# Altium schematic sheet AT89xx Development Kit.SchDoc: AT89xx Development Kit
size A4; Author: Tran Tuan; CompanyName: Vnelektronics Co.,Ltd; DrawnBy: Tran Tuan; Engineer: Tran Tuan; Organization: Vnelektronics Co.,Ltd; Address1: 776 Ton Duc Thang; Address2: Lien Chieu, Da Nang; Revision: 1.1; SheetNumber: 01; SheetTotal: 01; ProjectName: AT89xx Development Kit
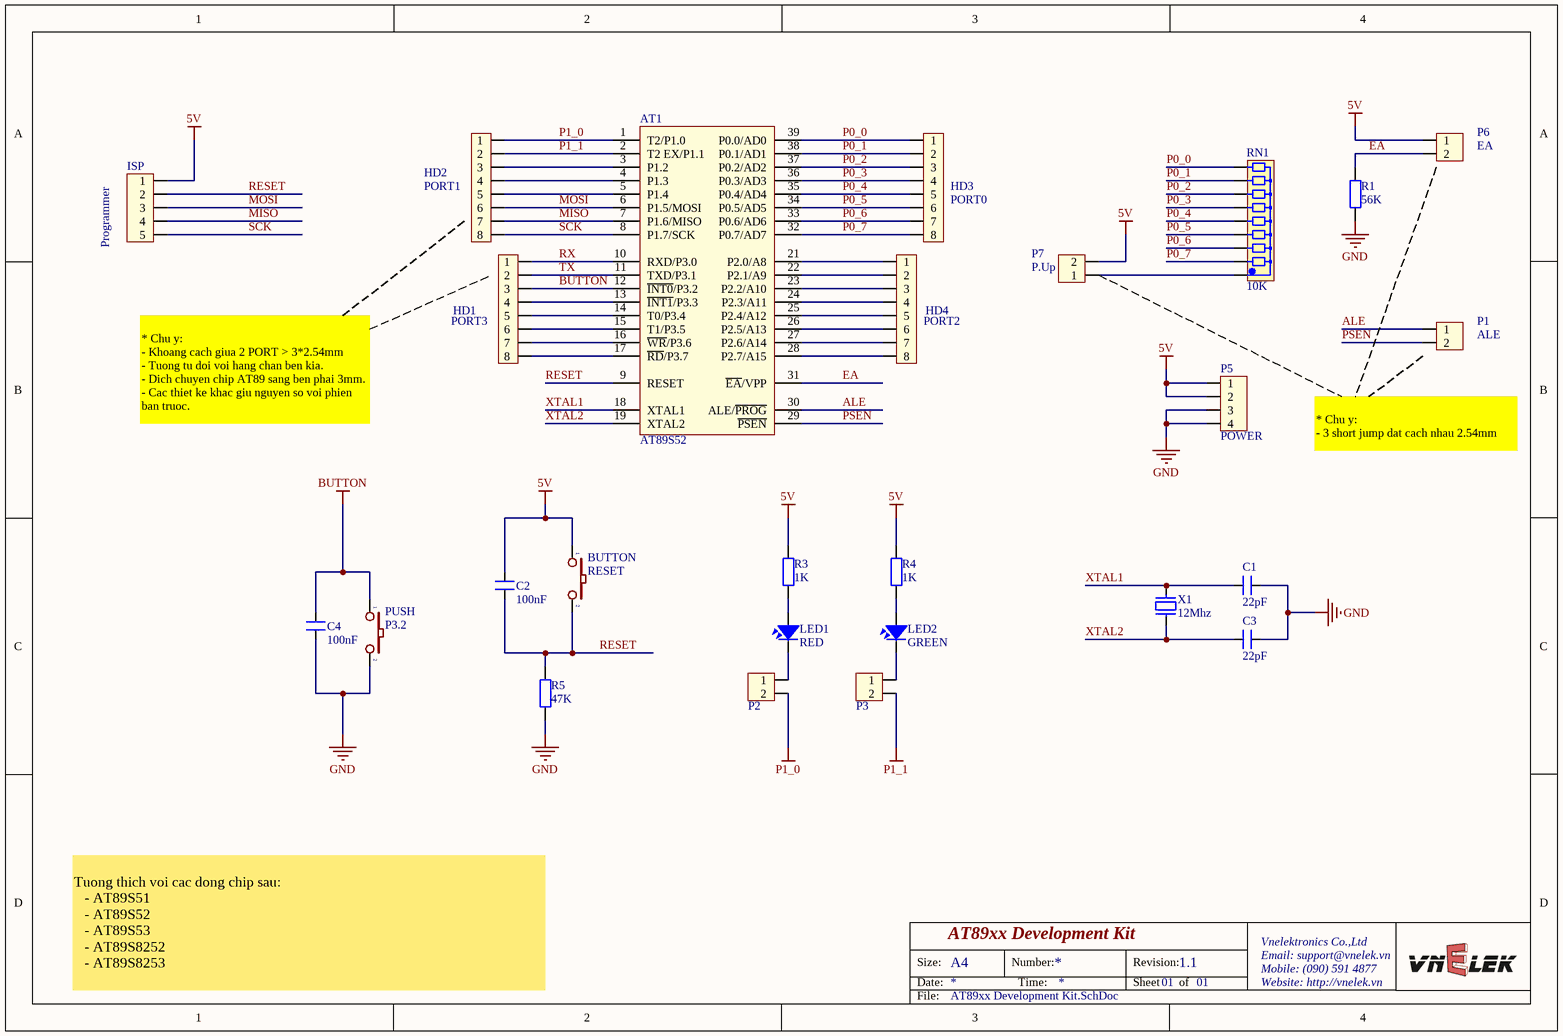
[diagram p0: AT89xx Development Kit.SchDoc]

## Parts
AT1  AT89S52  [de gat xanh dip 40]
BUTTON  RESET  [BUTTON 2PIN TRON]
C1  22pF  [C0603]
C2  100nF  [C0805]
C3  22pF  [C0603]
C4  100nF  [C0805]
HD1  PORT3  [Header_8]
HD2  PORT1  [Header_8]
HD3  PORT0  [Header_8]
HD4  PORT2  [Header_8]
ISP  Programmer  [Header_5]
LED1  RED  [Led 0805R]
LED2  GREEN  [Led 0805G]
P1  ALE  [Header_2]
P2  JUMP  [Header_2]  (value not drawn)
P3  JUMP  [Header_2]  (value not drawn)
P5  POWER  [Header_4]
P6  EA  [Header_2]
P7  P.Up  [Header_2]
PUSH  P3.2  [BUTTON 2PIN TRON]
R1  value 56K  [RESC2012(0805)]  (hidden comment: Res2)
R3  value 1K  [RESC2012(0805)]  (hidden comment: Res2)
R4  value 1K  [RESC2012(0805)]  (hidden comment: Res2)
R5  value 47K  [RESC2012(0805)]  (hidden comment: Res2)
RN1  10K  [RN8]
X1  12Mhz  [CRYSTAL]

## Nets
5V: AT1.40(5V) BUTTON.1 C2.1 ISP.1 P5.1 P5.2 P6.1 P7.2 R3.2 R4.2
BUTTON: AT1.12(~{INT0}/P3.2) C4.1 HD1.3 PUSH.1
GND: AT1.20(GND) C1.1 C3.1 C4.2 P5.3 P5.4 PUSH.2 R1.2 R5.2
P1_0: AT1.1(T2/P1.0) HD2.1 P2.2
P1_1: AT1.2(T2_EX/P1.1) HD2.2 P3.2
ALE: AT1.30(ALE/~{PROG}) P1.1
EA: AT1.31(~{EA}/VPP) P6.2 R1.1
MISO: AT1.7(P1.6/MISO) HD2.7 ISP.4
MOSI: AT1.6(P1.5/MOSI) HD2.6 ISP.3
P0_0: AT1.39(P0.0/AD0) HD3.1 RN1.9
P0_1: AT1.38(P0.1/AD1) HD3.2 RN1.8
P0_2: AT1.37(P0.2/AD2) HD3.3 RN1.7
P0_3: AT1.36(P0.3/AD3) HD3.4 RN1.6
P0_4: AT1.35(P0.4/AD4) HD3.5 RN1.5
P0_5: AT1.34(P0.5/AD5) HD3.6 RN1.4
P0_6: AT1.33(P0.6/AD6) HD3.7 RN1.3
P0_7: AT1.32(P0.7/AD7) HD3.8 RN1.2
PSEN: AT1.29(~{PSEN}) P1.2
RESET: AT1.9(RESET) BUTTON.2 C2.2 ISP.2 R5.1
RX: AT1.10(RXD/P3.0) HD1.1
SCK: AT1.8(P1.7/SCK) HD2.8 ISP.5
TX: AT1.11(TXD/P3.1) HD1.2
XTAL1: AT1.18(XTAL1) C1.2 X1.1
XTAL2: AT1.19(XTAL2) C3.2 X1.2
NetAT1_3: AT1.3(P1.2) HD2.3
NetAT1_4: AT1.4(P1.3) HD2.4
NetAT1_5: AT1.5(P1.4) HD2.5
NetAT1_13: AT1.13(~{INT1}/P3.3) HD1.4
NetAT1_14: AT1.14(T0/P3.4) HD1.5
NetAT1_15: AT1.15(T1/P3.5) HD1.6
NetAT1_16: AT1.16(~{WR}/P3.6) HD1.7
NetAT1_17: AT1.17(~{RD}/P3.7) HD1.8
NetAT1_21: AT1.21(P2.0/A8) HD4.1
NetAT1_22: AT1.22(P2.1/A9) HD4.2
NetAT1_23: AT1.23(P2.2/A10) HD4.3
NetAT1_24: AT1.24(P2.3/A11) HD4.4
NetAT1_25: AT1.25(P2.4/A12) HD4.5
NetAT1_26: AT1.26(P2.5/A13) HD4.6
NetAT1_27: AT1.27(P2.6/A14) HD4.7
NetAT1_28: AT1.28(P2.7/A15) HD4.8
NetLED1_1: LED1.1 R3.1
NetLED1_2: LED1.2 P2.1
NetLED2_1: LED2.1 R4.1
NetLED2_2: LED2.2 P3.1
NetP7_1: P7.1 RN1.1

## Notes on the sheet
- * Chu y:
  - Khoang cach giua 2 PORT > 3*2.54mm
  - Tuong tu doi voi hang chan ben kia.
  - Dich chuyen chip AT89 sang ben phai 3mm.
  - Cac thiet ke khac giu nguyen so voi phien ban truoc.
- * Chu y:
  - 3 short jump dat cach nhau 2.54mm
- Tuong thich voi cac dong chip sau:
  - AT89S51
  - AT89S52
  - AT89S53
  - AT89S8252
  - AT89S8253
- Size:
- Date:
- A4
- Number:
- Time:
- Revision:
- Sheet
- of
- Vnelektronics Co.,Ltd
- Mobile: (090) 591 4877
- Email: support@vnelek.vn
- Website: http://vnelek.vn
- File:

## Library data of the parts
AT1 = AT89S52: AT89S52, 8k Byte Flash Memory , 40 Pin; Value: AT89S52
BUTTON PUSH = SW2: Switch button 2 pin; Value: SW chip 2 pin
C1-C4 = CN1: Cap np  1pF - 472pF; Value: 100pF
HD1-HD4 = Hed8: Hedear 8; Creat by: VanDungEvn@Gmail.com
ISP = Hed5: Header 5 (Green); Value: Header 5
LED1 LED2 = LED: LED Single colour Green and Red; Value: LED 3 ly Single Colour
P1-P3 P6 P7 = Hed2: Header 2 (Green); Value: Header 2
P5 = Con4: Connector 4; Value: Connector 4
R1 R3-R5 = Res2: Resistor; Published: 8-Jun-2000; LatestRevisionDate: 17-Jul-2002; LatestRevisionNote: Re-released for DXP Platform.; PackageReference: AXIAL-0.4; Publisher: Altium Limited; PackageDescription: Axial Device, Thru-Hole; 2 Leads; 0.4 in Pin Spacing
RN1 = RN8: Resistor 8 (Thanh); Value: Tro thanh 10K
X1 = XT2: Crystal For all Crystal 2pin.; Value: 4Mhz